# EAGLE schematic lcpxpresso-mainboard (EAGLE 5.11)
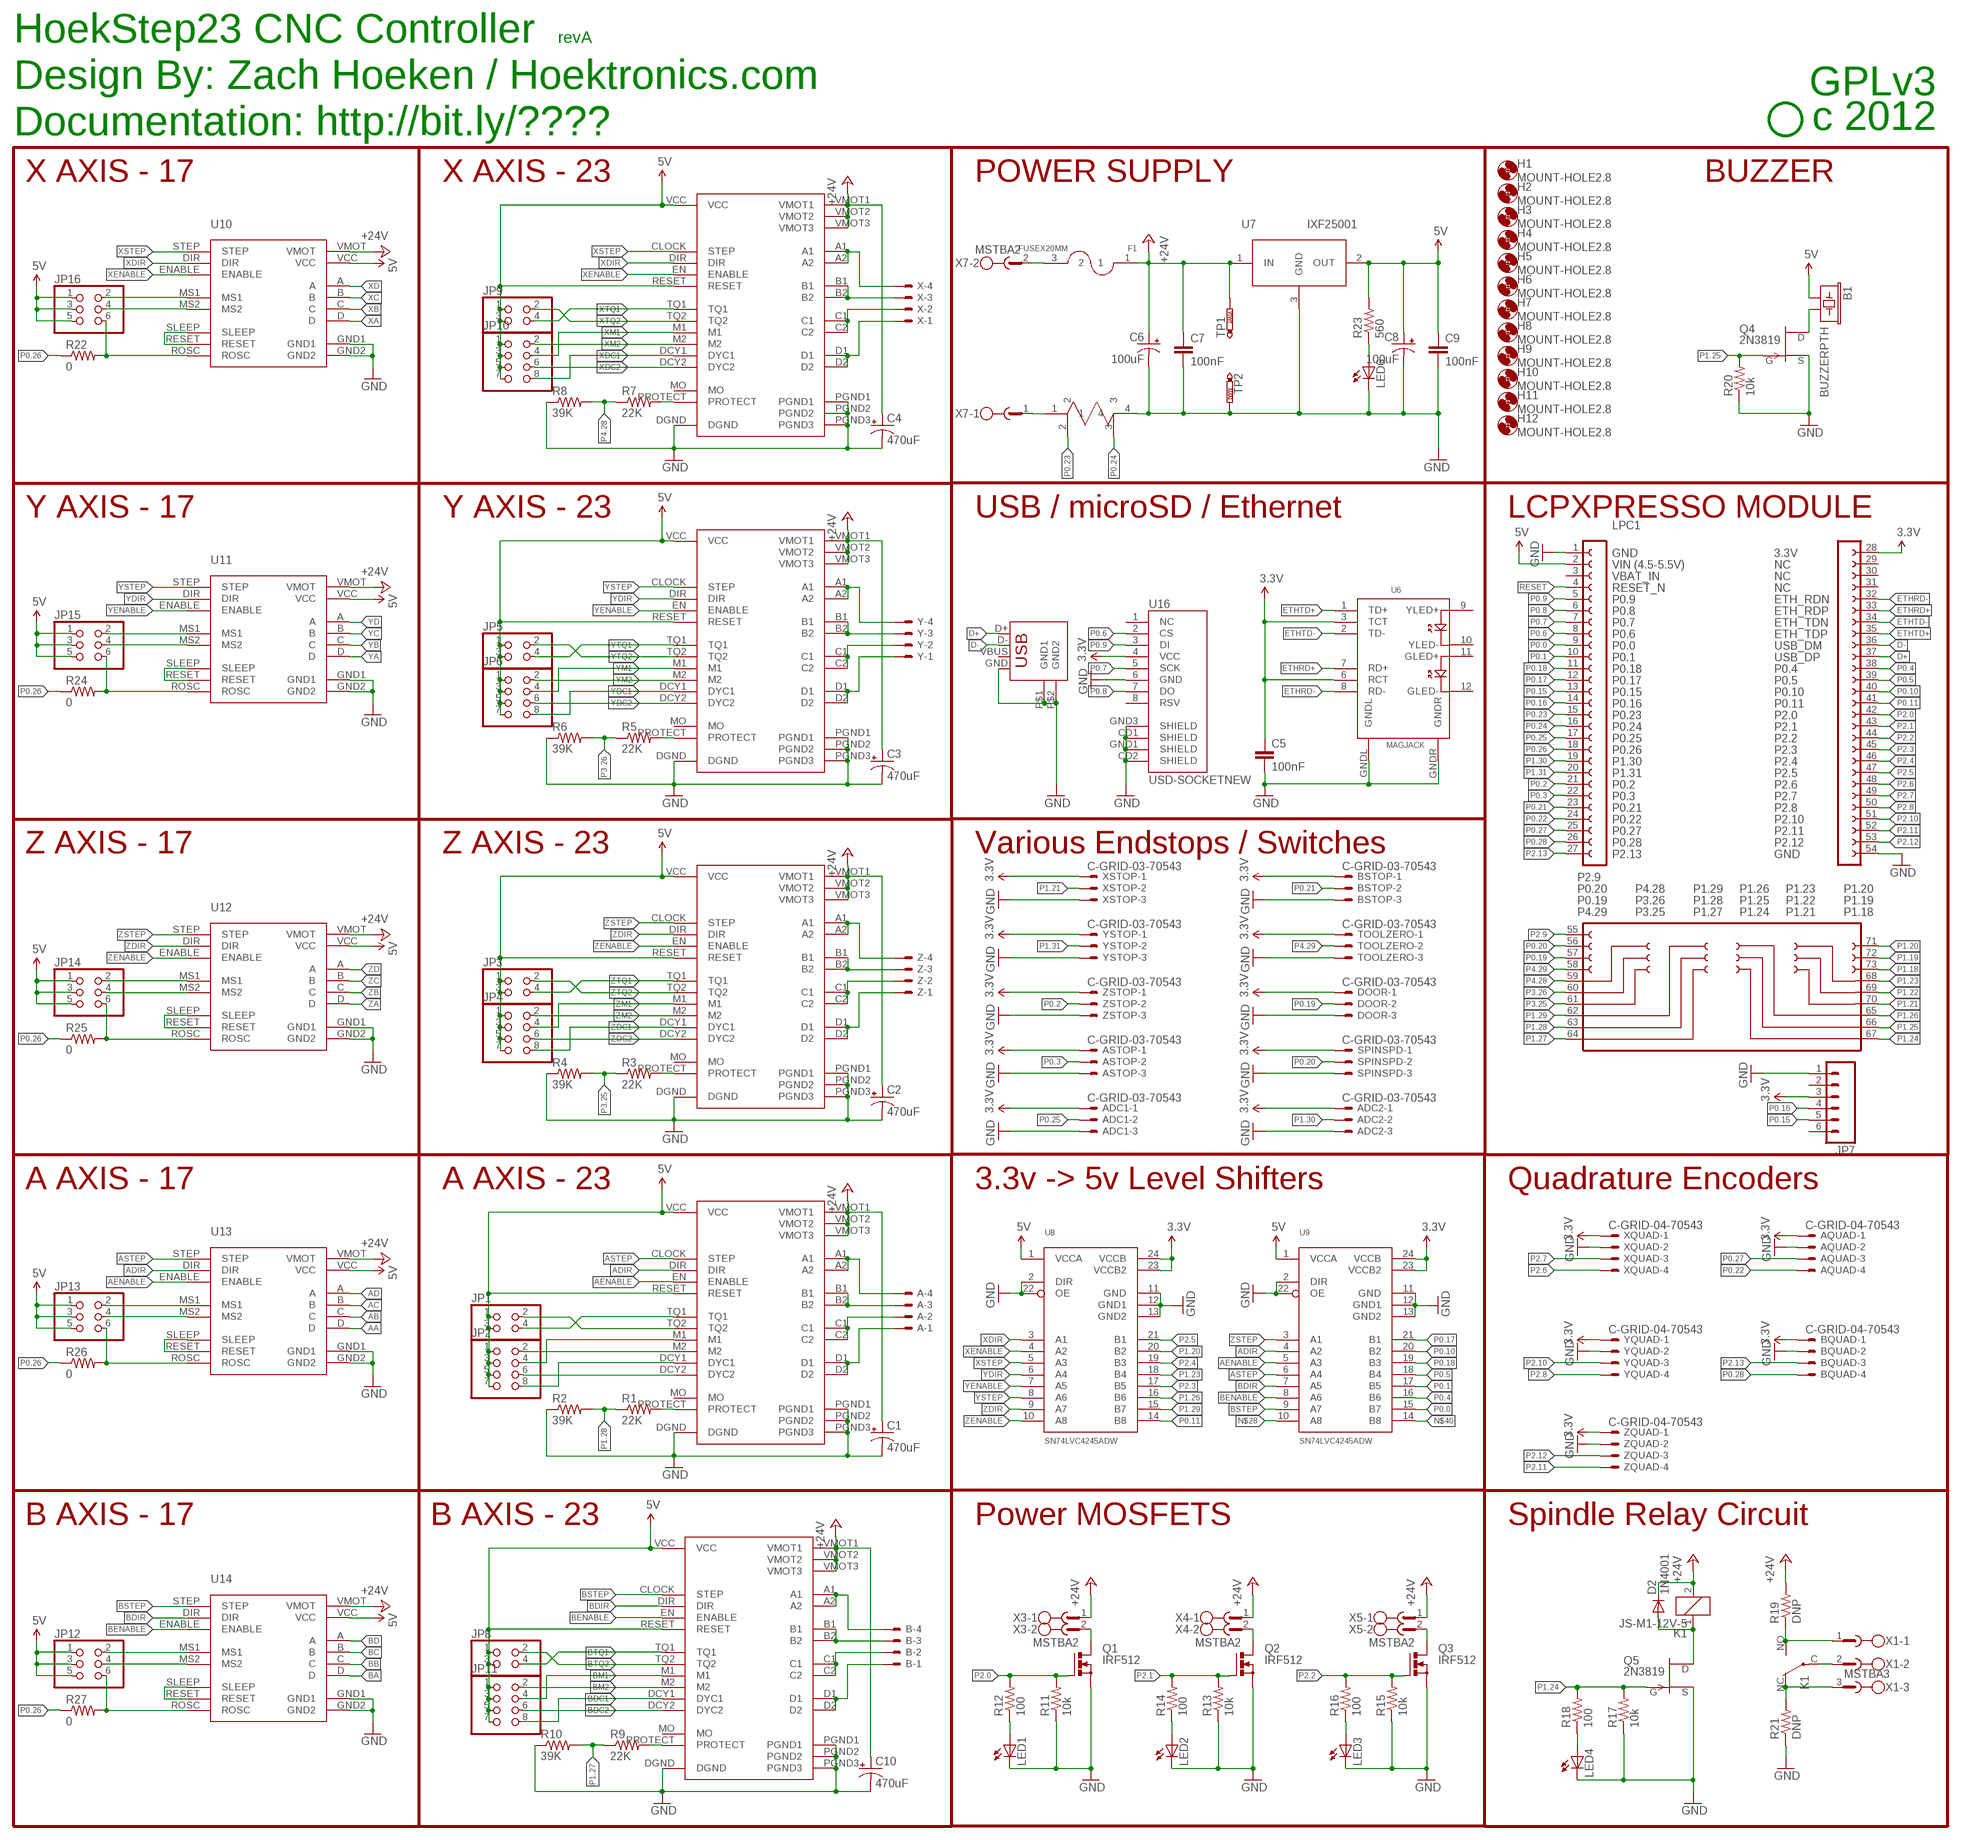
[diagram p0: schematic, sheet 1]

## Parts
A  KK-156-4  [KK-156-4]
ADC1  C-GRID-03-70543  [70543-03]
ADC2  C-GRID-03-70543  [70543-03]
AQUAD  C-GRID-04-70543  [70543-04]
ASTOP  C-GRID-03-70543  [70543-03]
B  KK-156-4  [KK-156-4]
B1  BUZZERPTH  [BUZZER-12MM]
BQUAD  C-GRID-04-70543  [70543-04]
BSTOP  C-GRID-03-70543  [70543-03]
C1  470uF  CPOL-USE3.5-8  [E3,5-8]
C2  470uF  CPOL-USE3.5-8  [E3,5-8]
C3  470uF  CPOL-USE3.5-8  [E3,5-8]
C4  470uF  CPOL-USE3.5-8  [E3,5-8]
C5  100nF  CAP0805  [0805]
C6  100uF  CPOL-USE2.5-7  [E2,5-7]
C7  100nF  CAP0805  [0805]
C8  100uF  CPOL-USE2.5-7  [E2,5-7]
C9  100nF  CAP0805  [0805]
C10  470uF  CPOL-USE3.5-8  [E3,5-8]
D2  1N4001  DIODEPTH  [DIODE-1N4001]
DOOR  C-GRID-03-70543  [70543-03]
F1  FUSEX20MM  [FUSE_5MM]
H1  MOUNT-HOLE2.8  [2,8]
H2  MOUNT-HOLE2.8  [2,8]
H3  MOUNT-HOLE2.8  [2,8]
H4  MOUNT-HOLE2.8  [2,8]
H5  MOUNT-HOLE2.8  [2,8]
H6  MOUNT-HOLE2.8  [2,8]
H7  MOUNT-HOLE2.8  [2,8]
H8  MOUNT-HOLE2.8  [2,8]
H9  MOUNT-HOLE2.8  [2,8]
H10  MOUNT-HOLE2.8  [2,8]
H11  MOUNT-HOLE2.8  [2,8]
H12  MOUNT-HOLE2.8  [2,8]
JP1  PINHD-2X2  [2X02]
JP2  PINHD-2X4  [2X04]
JP3  PINHD-2X2  [2X02]
JP4  PINHD-2X4  [2X04]
JP5  PINHD-2X2  [2X02]
JP6  PINHD-2X4  [2X04]
JP7  M06SIP  [1X06]
JP8  PINHD-2X2  [2X02]
JP9  PINHD-2X2  [2X02]
JP10  PINHD-2X4  [2X04]
JP11  PINHD-2X4  [2X04]
JP12  PINHD-2X3  [2X03]
JP13  PINHD-2X3  [2X03]
JP14  PINHD-2X3  [2X03]
JP15  PINHD-2X3  [2X03]
JP16  PINHD-2X3  [2X03]
K1  JS-M1-12V-5  [JS-M]
LED1  LED1206  [LED-1206]
LED2  LED1206  [LED-1206]
LED3  LED1206  [LED-1206]
LED4  LED1206  [LED-1206]
LED6  LED1206  [LED-1206]
LPC1  LPCXPRESSO_LPC1769  [LPCXPRESSO_LPC1769]
Q1  IRF512  [TO220BV]
Q2  IRF512  [TO220BV]
Q3  IRF512  [TO220BV]
Q4  2N3819  [TO92]
Q5  2N3819  [TO92]
R1  22K  R-US_R0805  [R0805]
R2  39K  R-US_R0805  [R0805]
R3  22K  R-US_R0805  [R0805]
R4  39K  R-US_R0805  [R0805]
R5  22K  R-US_R0805  [R0805]
R6  39K  R-US_R0805  [R0805]
R7  22K  R-US_R0805  [R0805]
R8  39K  R-US_R0805  [R0805]
R9  22K  R-US_R0805  [R0805]
R10  39K  R-US_R0805  [R0805]
R11  10k  R-US_R0805  [R0805]
R12  100  R-US_R0805  [R0805]
R13  10k  R-US_R0805  [R0805]
R14  100  R-US_R0805  [R0805]
R15  10k  R-US_R0805  [R0805]
R16  100  R-US_R0805  [R0805]
R17  10k  R-US_R0805  [R0805]
R18  100  R-US_R0805  [R0805]
R19  DNP  R-US_R2512  [R2512]
R20  10k  R-US_R0805  [R0805]
R21  DNP  R-US_R2512  [R2512]
R22  0  R-US_R0805  [R0805]
R23  560  R-US_R0805  [R0805]
R24  0  R-US_R0805  [R0805]
R25  0  R-US_R0805  [R0805]
R26  0  R-US_R0805  [R0805]
R27  0  R-US_R0805  [R0805]
R28  WSL3637  [WSL3637]
SPINSPD  C-GRID-03-70543  [70543-03]
TOOLZERO  C-GRID-03-70543  [70543-03]
TP1  PTR1PAD1-13  [P1-13]
TP2  PTR1PAD1-13  [P1-13]
U1  HOEKSTEP23  [HOEKSTEP23]
U2  HOEKSTEP23  [HOEKSTEP23]
U3  HOEKSTEP23  [HOEKSTEP23]
U4  HOEKSTEP23  [HOEKSTEP23]
U5  HOEKSTEP23  [HOEKSTEP23]
U6  MAGJACK  [MAGJACK]
U7  IXF25001  [TO252]
U8  SN74LVC4245ADW  [SO24W]
U9  SN74LVC4245ADW  [SO24W]
U10  HOEKSTEP17  [HOEKSTEP17]
U11  HOEKSTEP17  [HOEKSTEP17]
U12  HOEKSTEP17  [HOEKSTEP17]
U13  HOEKSTEP17  [HOEKSTEP17]
U14  HOEKSTEP17  [HOEKSTEP17]
U16  USD-SOCKETNEW  [MICRO-SD-SOCKET-PP]
X  KK-156-4  [KK-156-4]
X1  MSTBA3  [MSTBA3]
X2  USBPTH  [USB-B-PTH]
X3  MSTBA2  [MSTBA2]
X4  MSTBA2  [MSTBA2]
X5  MSTBA2  [MSTBA2]
X7  MSTBA2  [MSTBA2]
XQUAD  C-GRID-04-70543  [70543-04]
XSTOP  C-GRID-03-70543  [70543-03]
Y  KK-156-4  [KK-156-4]
YQUAD  C-GRID-04-70543  [70543-04]
YSTOP  C-GRID-03-70543  [70543-03]
Z  KK-156-4  [KK-156-4]
ZQUAD  C-GRID-04-70543  [70543-04]
ZSTOP  C-GRID-03-70543  [70543-03]

## Nets
3.3V: ADC1.1 ADC2.1 AQUAD.1 ASTOP.1 BQUAD.1 BSTOP.1 C5.1 DOOR.1 JP7.3 LPC1.28 SPINSPD.1 TOOLZERO.1 U6.3(TCT) U6.6(RCT) U8.23(VCCB2) U8.24(VCCB) U9.23(VCCB2) U9.24(VCCB) U16.4(VCC) XQUAD.1 XSTOP.1 YQUAD.1 YSTOP.1 ZQUAD.1 ZSTOP.1
5V: B1.+ C8.+ C9.1 JP1.1 JP1.3 JP2.1 JP2.3 JP2.5 JP2.7 JP3.1 JP3.3 JP4.1 JP4.3 JP4.5 JP4.7 JP5.1 JP5.3 JP6.1 JP6.3 JP6.5 JP6.7 JP8.1 JP8.3 JP9.1 JP9.3 JP10.1 JP10.3 JP10.5 JP10.7 JP11.1 JP11.3 JP11.5 JP11.7 JP12.1 JP12.3 JP12.5 JP13.1 JP13.3 JP13.5 JP14.1 JP14.3 JP14.5 JP15.1 JP15.3 JP15.5 JP16.1 JP16.3 JP16.5 LPC1.2 R23.2 U1.RESET U1.VCC U2.RESET U2.VCC U3.RESET U3.VCC U4.RESET U4.VCC U5.RESET U5.VCC U7.2(OUT) U8.1(VCCA) U9.1(VCCA) U10.VCC U11.VCC U12.VCC U13.VCC U14.VCC
+24V [power]: C1.+ C2.+ C3.+ C4.+ C6.+ C7.1 C10.+ D2.C F1.1 K1.2 R19.2 TP1.TP U1.VMOT1 U1.VMOT2 U1.VMOT3 U2.VMOT1 U2.VMOT2 U2.VMOT3 U3.VMOT1 U3.VMOT2 U3.VMOT3 U4.VMOT1 U4.VMOT2 U4.VMOT3 U5.VMOT1 U5.VMOT2 U5.VMOT3 U7.1(IN) U10.VMOT U11.VMOT U12.VMOT U13.VMOT U14.VMOT X3.1 X4.1 X5.1
AA [power]: A.4 U4.A1 U4.A2 U13.D
AB [power]: A.3 U4.B1 U4.B2 U13.C
AC [power]: A.2 U4.C1 U4.C2 U13.B
AD [power]: A.1 U4.D1 U4.D2 U13.A
ADC1 [signals]: JP2.8 U4.DCY1(DYC1)
ADC2 [signals]: JP2.6 U4.DCY2(DYC2)
ADIR [signals]: U4.DIR U9.4(A2) U13.DIR
AENABLE [signals]: U4.EN(ENABLE) U9.5(A3) U13.ENABLE
AM1 [signals]: JP2.4 U4.M1
AM2 [signals]: JP2.2 U4.M2
ASTEP [signals]: U4.CLOCK(STEP) U9.6(A4) U13.STEP
ATQ1 [signals]: JP1.4 U4.TQ1
ATQ2 [signals]: JP1.2 U4.TQ2
BA [power]: B.4 U5.A1 U5.A2 U14.D
BB [power]: B.3 U5.B1 U5.B2 U14.C
BC [power]: B.2 U5.C1 U5.C2 U14.B
BD [power]: B.1 U5.D1 U5.D2 U14.A
BDC1 [signals]: JP11.8 U5.DCY1(DYC1)
BDC2 [signals]: JP11.6 U5.DCY2(DYC2)
BDIR [signals]: U5.DIR U9.7(A5) U14.DIR
BENABLE [signals]: U5.EN(ENABLE) U9.8(A6) U14.ENABLE
BM1 [signals]: JP11.4 U5.M1
BM2 [signals]: JP11.2 U5.M2
BSTEP [signals]: U5.CLOCK(STEP) U9.9(A7) U14.STEP
BTQ1 [signals]: JP8.4 U5.TQ1
BTQ2 [signals]: JP8.2 U5.TQ2
D+ [signals]: LPC1.37 X2.D+
D- [signals]: LPC1.36 X2.D-
ETHRD+ [signals]: LPC1.33 U6.7(RD+)
ETHRD- [signals]: LPC1.32 U6.8(RD-)
ETHTD+ [signals]: LPC1.35 U6.1(TD+)
ETHTD- [signals]: LPC1.34 U6.2(TD-)
GND: ADC1.3 ADC2.3 AQUAD.2 ASTOP.3 BQUAD.2 BSTOP.3 C1.- C2.- C3.- C4.- C5.2 C6.- C7.2 C8.- C9.2 C10.- DOOR.3 JP7.1 LED1.C LED2.C LED3.C LED4.C LED6.C LPC1.1 LPC1.54 Q1.S Q2.S Q3.S Q4.3(S) Q5.3(S) R2.1 R4.1 R6.1 R8.1 R10.1 R11.1 R13.1 R15.1 R17.1 R20.1 R21.1 R28.4 SPINSPD.3 TOOLZERO.3 TP2.TP U1.DGND U1.PGND1 U1.PGND2 U1.PGND3 U2.DGND U2.PGND1 U2.PGND2 U2.PGND3 U3.DGND U3.PGND1 U3.PGND2 U3.PGND3 U4.DGND U4.PGND1 U4.PGND2 U4.PGND3 U5.DGND U5.PGND1 U5.PGND2 U5.PGND3 U6.GNDL U6.GNDR U7.3(GND) U8.2(DIR) U8.11(GND) U8.12(GND1) U8.13(GND2) U8.22(OE) U9.2(DIR) U9.11(GND) U9.12(GND1) U9.13(GND2) U9.22(OE) U10.GND1 U10.GND2 U11.GND1 U11.GND2 U12.GND1 U12.GND2 U13.GND1 U13.GND2 U14.GND1 U14.GND2 U16.6(GND) U16.CD1(SHIELD) U16.CD2(SHIELD) U16.GND1(SHIELD) U16.GND3(SHIELD) X2.GND X2.P$1(GND1) X2.P$2(GND2) XQUAD.2 XSTOP.3 YQUAD.2 YSTOP.3 ZQUAD.2 ZSTOP.3
N$1: U10.RESET U10.SLEEP
N$2: U11.RESET U11.SLEEP
N$3: U12.RESET U12.SLEEP
N$4: U13.RESET U13.SLEEP
N$5: U14.RESET U14.SLEEP
N$6: F1.3 X7.2
N$7: JP16.2 U10.MS1
N$8: R3.2 U3.PROTECT
N$9: JP16.4 U10.MS2
N$10: JP16.6 R22.2 U10.ROSC
N$11: JP15.2 U11.MS1
N$12: JP15.4 U11.MS2
N$13: JP15.6 R24.2 U11.ROSC
N$14: JP14.2 U12.MS1
N$15 [highvolt]: K1.NO(2:S) R19.1 X1.1
N$16: R1.2 U4.PROTECT
N$17 [power]: Q1.D X3.2
N$18 [signals]: LED1.A R12.1
N$19 [power]: Q2.D X4.2
N$20 [signals]: LED2.A R14.1
N$21: JP14.4 U12.MS2
N$22: JP14.6 R25.2 U12.ROSC
N$23: JP13.2 U13.MS1
N$24: JP13.4 U13.MS2
N$25 [power]: Q3.D X5.2
N$26 [signals]: LED3.A R16.1
N$27: R28.1 X7.1
N$28 [signals]: U9.10(A8)
N$29 [highvolt]: K1.C(2:P) X1.2
N$30: D2.A K1.1 Q5.1(D)
N$31: JP13.6 R26.2 U13.ROSC
N$32: JP12.2 U14.MS1
N$33: JP12.4 U14.MS2
N$34: JP12.6 R27.2 U14.ROSC
N$35 [signals]: LED4.A R18.1
N$37 [highvolt]: K1.NC(2:O) R21.2 X1.3
N$38 [signals]: B1.- Q4.1(D)
N$39: LED6.A R23.1
N$40 [signals]: U9.14(B8)
N$42: R9.2 U5.PROTECT
N$43: R7.2 U1.PROTECT
N$44: R5.2 U2.PROTECT
P0.0 [signals]: LPC1.9 U9.15(B7)
P0.1 [signals]: LPC1.10 U9.17(B5)
P0.2 [signals]: LPC1.21 ZSTOP.2
P0.3 [signals]: ASTOP.2 LPC1.22
P0.4 [signals]: LPC1.38 U9.16(B6)
P0.5 [signals]: LPC1.39 U9.18(B4)
P0.6 [signals]: LPC1.8 U16.2(CS)
P0.7 [signals]: LPC1.7 U16.5(SCK)
P0.8 [signals]: LPC1.6 U16.7(DO)
P0.9 [signals]: LPC1.5 U16.3(DI)
P0.10 [signals]: LPC1.40 U9.20(B2)
P0.11 [signals]: LPC1.41 U8.14(B8)
P0.15: JP7.5 LPC1.13
P0.16: JP7.4 LPC1.14
P0.17 [signals]: LPC1.12 U9.21(B1)
P0.18 [signals]: LPC1.11 U9.19(B3)
P0.19 [signals]: DOOR.2 LPC1.57
P0.20 [signals]: LPC1.56 SPINSPD.2
P0.21 [signals]: BSTOP.2 LPC1.23
P0.22 [signals]: AQUAD.4 LPC1.24
P0.23 [signals]: LPC1.15 R28.2
P0.24 [signals]: LPC1.16 R28.3
P0.25 [signals]: ADC1.2 LPC1.17
P0.26 [signals]: LPC1.18 R22.1 R24.1 R25.1 R26.1 R27.1
P0.27 [signals]: AQUAD.3 LPC1.25
P0.28 [signals]: BQUAD.4 LPC1.26
P1.18: LPC1.73
P1.19: LPC1.72
P1.20 [signals]: LPC1.71 U8.20(B2)
P1.21: LPC1.70 XSTOP.2
P1.22: LPC1.69
P1.23 [signals]: LPC1.68 U8.18(B4)
P1.24 [signals]: LPC1.67 Q5.2(G) R17.2 R18.2
P1.25 [signals]: LPC1.66 Q4.2(G) R20.2
P1.26 [signals]: LPC1.65 U8.16(B6)
P1.27 [signals]: LPC1.64 R9.1 R10.2
P1.28 [signals]: LPC1.63 R1.1 R2.2
P1.29 [signals]: LPC1.62 U8.15(B7)
P1.30 [signals]: ADC2.2 LPC1.19
P1.31 [signals]: LPC1.20 YSTOP.2
P2.0 [signals]: LPC1.42 Q1.G R11.2 R12.2
P2.1 [signals]: LPC1.43 Q2.G R13.2 R14.2
P2.2 [signals]: LPC1.44 Q3.G R15.2 R16.2
P2.3 [signals]: LPC1.45 U8.17(B5)
P2.4 [signals]: LPC1.46 U8.19(B3)
P2.5 [signals]: LPC1.47 U8.21(B1)
P2.6 [signals]: LPC1.48 XQUAD.4
P2.7 [signals]: LPC1.49 XQUAD.3
P2.8 [signals]: LPC1.50 YQUAD.4
P2.9: LPC1.55
P2.10 [signals]: LPC1.51 YQUAD.3
P2.11 [signals]: LPC1.52 ZQUAD.4
P2.12 [signals]: LPC1.53 ZQUAD.3
P2.13 [signals]: BQUAD.3 LPC1.27
P3.25 [signals]: LPC1.61 R3.1 R4.2
P3.26 [signals]: LPC1.60 R5.1 R6.2
P4.28 [signals]: LPC1.59 R7.1 R8.2
P4.29 [signals]: LPC1.58 TOOLZERO.2
RESET: LPC1.4
XA [power]: U1.A1 U1.A2 U10.D X.4
XB [power]: U1.B1 U1.B2 U10.C X.3
XC [power]: U1.C1 U1.C2 U10.B X.2
XD [power]: U1.D1 U1.D2 U10.A X.1
XDC1 [signals]: JP10.8 U1.DCY1(DYC1)
XDC2 [signals]: JP10.6 U1.DCY2(DYC2)
XDIR [signals]: U1.DIR U8.3(A1) U10.DIR
XENABLE [signals]: U1.EN(ENABLE) U8.4(A2) U10.ENABLE
XM1 [signals]: JP10.4 U1.M1
XM2 [signals]: JP10.2 U1.M2
XSTEP [signals]: U1.CLOCK(STEP) U8.5(A3) U10.STEP
XTQ1 [signals]: JP9.4 U1.TQ1
XTQ2 [signals]: JP9.2 U1.TQ2
YA [power]: U2.A1 U2.A2 U11.D Y.4
YB [power]: U2.B1 U2.B2 U11.C Y.3
YC [power]: U2.C1 U2.C2 U11.B Y.2
YD [power]: U2.D1 U2.D2 U11.A Y.1
YDC1 [signals]: JP6.8 U2.DCY1(DYC1)
YDC2 [signals]: JP6.6 U2.DCY2(DYC2)
YDIR [signals]: U2.DIR U8.6(A4) U11.DIR
YENABLE [signals]: U2.EN(ENABLE) U8.7(A5) U11.ENABLE
YM1 [signals]: JP6.4 U2.M1
YM2 [signals]: JP6.2 U2.M2
YSTEP [signals]: U2.CLOCK(STEP) U8.8(A6) U11.STEP
YTQ1 [signals]: JP5.4 U2.TQ1
YTQ2 [signals]: JP5.2 U2.TQ2
ZA [power]: U3.A1 U3.A2 U12.D Z.4
ZB [power]: U3.B1 U3.B2 U12.C Z.3
ZC [power]: U3.C1 U3.C2 U12.B Z.2
ZD [power]: U3.D1 U3.D2 U12.A Z.1
ZDC1 [signals]: JP4.8 U3.DCY1(DYC1)
ZDC2 [signals]: JP4.6 U3.DCY2(DYC2)
ZDIR [signals]: U3.DIR U8.9(A7) U12.DIR
ZENABLE [signals]: U3.EN(ENABLE) U8.10(A8) U12.ENABLE
ZM1 [signals]: JP4.4 U3.M1
ZM2 [signals]: JP4.2 U3.M2
ZSTEP [signals]: U3.CLOCK(STEP) U9.3(A1) U12.STEP
ZTQ1 [signals]: JP3.4 U3.TQ1
ZTQ2 [signals]: JP3.2 U3.TQ2
Unconnected: JP7.2 JP7.6 LPC1.3 LPC1.29 LPC1.30 LPC1.31 U1.MO U2.MO U3.MO U4.MO U5.MO U6.9(YLED+) U6.10(YLED-) U6.11(GLED+) U6.12(GLED-) U16.1(NC) U16.8(RSV) X2.VBUS

## Notes on the sheet
- HoekStep23 CNC Controller | revA
- GPLv3
- Design By: Zach Hoeken / Hoektronics.com | c 2012
- Documentation: http://bit.ly/????
- X AXIS - 17 | X AXIS - 23 | POWER SUPPLY | BUZZER
- Y AXIS - 17 | Y AXIS - 23 | USB / microSD / Ethernet | LCPXPRESSO MODULE
- Z AXIS - 17 | Z AXIS - 23 | Various Endstops / Switches
- A AXIS - 17 | A AXIS - 23 | 3.3v -> 5v Level Shifters | Quadrature Encoders
- B AXIS - 17 | B AXIS - 23 | Power MOSFETS | Spindle Relay Circuit

## Library data of the parts
A B X Y Z = con-molex:KK-156-4: KK 156 HEADER Source: http://www.molex.com/pdm_docs/sd/026604100_sd.pdf; OC_FARNELL: unknown; OC_NEWARK: unknown
ADC1 ADC2 ASTOP BSTOP DOOR SPINSPD TOOLZERO XSTOP YSTOP ZSTOP = con-molex:C-GRID-03: CONNECTOR wire to board 2.54 mm (0.100") pitch header; OC_FARNELL: unknown; OC_NEWARK: unknown
AQUAD BQUAD XQUAD YQUAD ZQUAD = con-molex:C-GRID-04: CONNECTOR wire to board 2.54 mm (0.100") pitch header; OC_FARNELL: unknown; OC_NEWARK: unknown
B1 = SparkFun:BUZZER: Buzzer 12mm Spark Fun Electronics SKU : Comp-Buzzer
C1-C4 C6 C8 C10 = rcl:CPOL-US: POLARIZED CAPACITOR, American symbol
C5 C7 C9 = SparkFun:CAP: Capacitor Standard 0603 ceramic capacitor, and 0.1" leaded capacitor.
D2 = SparkFun:DIODE: Diode These are standard reverse protection diodes and small signal diodes. SMA package can handle up to about 1A. SOD-323 can handle about 200mA. What the SOD-323 package when ordering, there are some mfgs out there that are 5-pin packages.
F1 = SparkFun:FUSE
H1-H12 = holes:MOUNT-HOLE: MOUNTING HOLE with drill center marker
JP1 JP3 JP5 JP8 JP9 = pinhead:PINHD-2X2: PIN HEADER
JP2 JP4 JP6 JP10 JP11 = pinhead:PINHD-2X4: PIN HEADER
JP7 = SparkFun:M06: Header 6 Standard 6-pin 0.1" header. Use with straight break away headers (SKU : PRT-00116), right angle break away headers (PRT-00553), swiss pins (PRT-00743), machine pins (PRT-00117), and female headers (PRT-00115). Molex polarized connector foot print use with SKU : PRT-08094 with associated crimp pins and housings. NOTES ON THE VARIANTS LOCK and LOCK_LONGPADS... This footprint was designed to help hold the alignment of a through-hole component (i.e. 6-pin header) while soldering it into place. You may notice that each hole has been shifted either up or down by 0.005 of an inch from it's more standard position (which is a perfectly straight line). This slight alteration caused the pins (the squares in the middle) to touch the edges of the holes. Because they are alternating, it causes a "brace" to hold the component in place. 0.005 has proven to be the perfect amount of "off-center" position when using our standard breakaway headers. Although looks a little odd when you look at the bare footprint, once you have a header in there, the alteration is very hard to notice. Also, if you push a header all the way into place, it is covered up entirely on the bottom side. This idea of altering the position of holes to aid alignment will be further integrated into the Sparkfun Library for other footprints. It can help hold any component with 3 or more connection pins.
JP12-JP16 = SparkFun:PINHD-2X3: PIN HEADER
K1 = relay:JS-M1*: Automotive Ultra-Miniature Power Relay NAiS Source: http://www.mew-europe.com/.. en_ds_61211_0000.pdf
LED1-LED4 LED6 = SparkFun:LED: LEDs Standard schematic elements and footprints for 5mm, 3mm, 1206, and 0603 sized LEDs. 5mm - Spark Fun Electronics SKU : COM-00529 (and others)
LPC1 = LPCXpresso_boards:LPCXPRESSO_LPC1769
Q1-Q3 = transistor-power:IRF512: N-CHANNEL MOS FET
Q4 Q5 = transistor-fet:2N3819: N-Channel Junction FET
R1-R27 = resistor:R-US_: RESISTOR, American symbol
R28 = Hoektronics:WSL3637
TP1 TP2 = testpad:PTR1: TEST PIN
U1-U5 = Hoektronics:HOEKSTEP23
U6 = Hoektronics:MAGJACK
U7 = Hoektronics:IXF25001
U8 U9 = MakerBot:SN74LVC4245A
U10-U14 = Hoektronics:HOEKSTEP17
U16 = SparkFun:USD-SOCKET: microSD Socket Push-push type uSD socket. Schematic element and footprint production proven. Spark Fun Electronics SKU : PRT-00127. tDoc lines correctly indicate media card edge positions when inserting (unlocked, locked, depressed).
X1 = con-phoenix-508:MSTBA3: PHOENIX; MF: FARNELL; MPN: 1757255; OC_FARNELL: 3705183; OC_NEWARK: 71C4162
X2 = Hoektronics:USB: USB Connectors USB-B-PTH is fully proven SKU : PRT-00139 USB-miniB is fully proven SKU : PRT-00587 USB-A-PCB is untested. USB-A-H is throughly reviewed, but untested. Spark Fun Electronics SKU : PRT-00437 USB-B-SMT is throughly reviewed, but untested. Needs silkscreen touching up. USB-A-S has not been used/tested USB-MB-H has not been used/tested
X3-X5 X7 = con-phoenix-508:MSTBA2: PHOENIX; MF: FARNELL; MPN: 1757242; OC_FARNELL: 3705171; OC_NEWARK: 71C4161

## Net classes
0 default: width 0.406 mm, clearance 0.381 mm
1 power: width 1.524 mm, clearance 0.635 mm
2 highvolt: width 1.778 mm, clearance 3.175 mm
3 signals: width 0.254 mm, clearance 0.318 mm